# Altium project o_cam_esp.PrjPcb
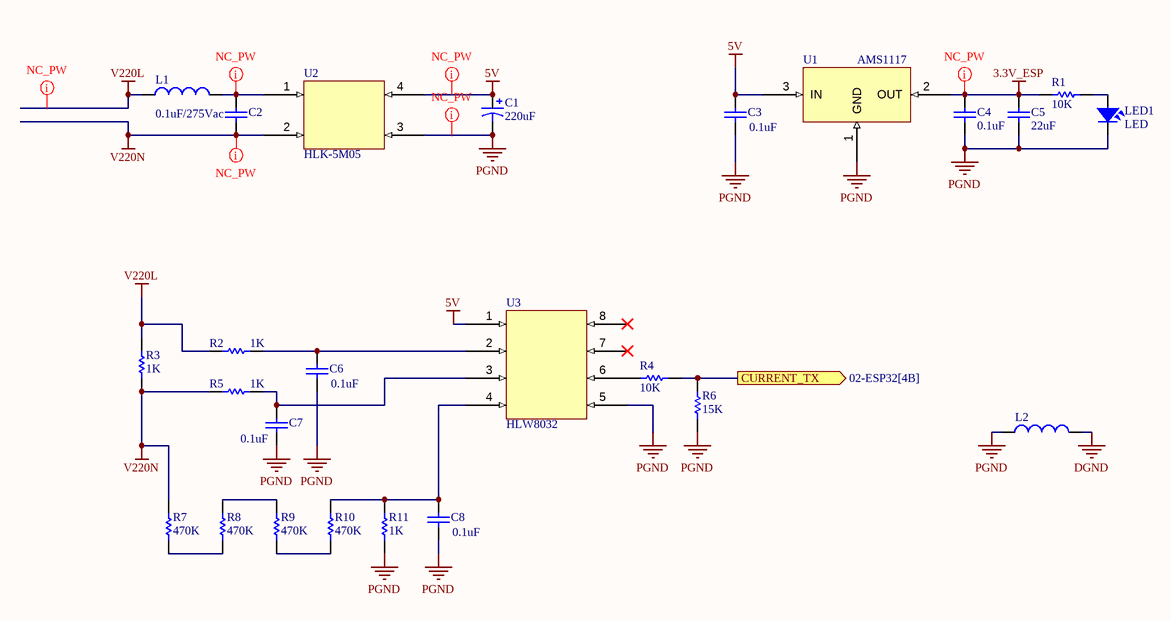
[diagram p0: 01-POWER.SchDoc]
4 sheets, 74 parts. Net scope: flat (ports and power ports of the same name join across sheets).
Board file: PCB1.PcbDoc
Sheets:
  01-POWER.SchDoc
  02-ESP32.SchDoc
  04-OUTPUT.SchDoc
  05-USB-UART.SchDoc

## Sheet 01-POWER.SchDoc: *NGUON4V4
size A4; SheetNumber: 1; SheetTotal: 4

### Parts
C1  220uF  [CAP ALU CASE G SMD]
C2  0.1uF/275Vac  [CN2]
C3  0.1uF  [CAP_CERA_C2012(CC0805INCH)]
C4  0.1uF  [CAP_CERA_C2012(CC0805INCH)]
C5  22uF  [CAP TANT CASE A SMD]
C6  0.1uF  [Cap Ceramic 0603 SMD]
C7  0.1uF  [Cap Ceramic 0603 SMD]
C8  0.1uF  [Cap Ceramic 0603 SMD]
L1  ASPI-7318-8R2M-TCT-ND  [FUSE2_5A]  (value not drawn)
L2  ASPI-7318-8R2M-TCT-ND  [RES-ERJ3G-1608MM]  (value not drawn)
LED1  LED  [LED5R]
R1  10K  [Res 0603 SMD]
R2  1K  [Res 0603 SMD]
R3  1K  [CFR25S]
R4  10K  [Res 0603 SMD]
R5  1K  [Res 0603 SMD]
R6  15K  [Res 0603 SMD]
R7  470K  [Res 0603 SMD]
R8  470K  [Res 0603 SMD]
R9  470K  [Res 0603 SMD]
R10  470K  [Res 0603 SMD]
R11  1K  [Res 0603 SMD]
U1  AMS1117  [AMS1117-3.3V]
U2  HLK-5M05  [HILINK 5V/3W]
U3  HLW8032  [SO-8]

### Ports
CURRENT_TX (out, see 02-ESP32[4B])

### Nets
3.3V_ESP: C4.2 C5.2 R1.1 U1.2(OUT)
5V: C1.1 C3.2 U1.3(IN) U2.4 U3.1
DGND: L2.2
PGND: C1.2 C3.1 C4.1 C5.1 C6.1 C7.1 C8.1 L2.1 LED1.2 R6.2 R11.1 U1.1(GND) U2.3 U3.5
V220L: L1.1 R2.2 R3.1
V220N: C2.1 R3.2 R5.2 R7.1 U2.2
NetC2_2: C2.2 L1.2 U2.1
NetC6_2: C6.2 R2.1 U3.2
NetC7_2: C7.2 R5.1 U3.3
NetC8_2: C8.2 R10.1 R11.2 U3.4
NetLED1_1: LED1.1 R1.2
NetR4_1: R4.1 U3.6
NetR4_2: R4.2 R6.1 ; port CURRENT_TX
NetR7_2: R7.2 R8.2
NetR8_1: R8.1 R9.1
NetR9_2: R9.2 R10.2

Not connected (* = marked no-connect by the designer): U3 7* 8*

### Layout directives
net class NC_PW: 3.3V_ESP, 5V, NetC2_2, PGND, V220L, V220N

### Notes on the sheet
- DWG. NO.
- REV.
- SHT.
- THIS DOCUMENT AND THE DATA DISCLOSED HEREIN OR HEREWITH IS THE PROPERTY OF ALTIUM LIMITED AND MAY BE FREELY DISTRIBUTED IN WHOLE. NO RIGHTS ARE RESERVED OR EXPRESS OR IMPLIED WARANTEE GIVEN.
- REVISION
- DESCRIPTION
- DATE
- APPROVED
- ENG:
- APPROVALS
- PROJECT
- DSN:
- CHK:
- REFERENCE DOCUMENTS
- PROJECT REVISION:
- TITLE
- DOCUMENT REVISION:
- DESIGN ITEM:
- BOM:
- FAB DWG:
- PCB DWG:
- ASSY DWG:
- SCALE:
- SIZE
- B
- CAGE CODE
- FILE NAME
- DWG NO.
- SHEET
- OF
- REV

### Library data of the parts
C1 = 330uF/50V/ALU12.5X20mm/20%/7000Hrs: CAP ALU 220UF 20% 50V SMD; Manufacturer: Nichicon; Manufacturer Part Number: UPW1J331MHD; Lifetime @ Temp.: 7000 Hrs @ 105°C; Polarization: Polar; Ripple Current - Low Frequency: 838.5mA @ 120Hz; Ripple Current - High Frequency: 1.29A @ 100kHz; RoHS: RoHS Compliant; Category: Capacitors; Packaging: Bulk; Part Status: Active; Tolerance: ±20%; ESR (Equivalent Series Resistance): -; Operating Temperature: -55°C ~ 105°C; Applications: General Purpose; Lead Spacing: 0.197" (5.00mm); Size / Dimension: 0.492" Dia (12.50mm); Height - Seated (Max): 0.787" (20.00mm); Surface Mount Land Size: -; Mounting Type: Through Hole; Package / Case: Radial, Can; ComponentLink1URL: http://nichicon-us.com/english/products/pdfs/e-upw.pdf; ComponentLink1Description: http://nichicon-us.com/english/products/pdfs/e-upw.pdf; Supplier 1: Digi-Key; Supplier Part Number 1: PCE5121TR-ND
C2 = 0.1uF/50V/C0603/10%: Manufacturer: Murata; ComponentLink1URL: http://www.murata.com/~/media/webrenewal/support/library/catalog/products/capacitor/mlcc/c02e.ashx; ComponentLink1Description: http://www.murata.com/~/media/webrenewal/support/library/catalog/products/capacitor/mlcc/c02e.ashx; Digikey: 490-9961-1-ND
C3 C4 = 0.1uF/50V/C0603/10%: 0.1µF ±10% 25V Ceramic Capacitor X7R 0805 (2012 Metric); ComponentLink1URL: http://www.murata.com/~/media/webrenewal/support/library/catalog/products/capacitor/mlcc/c02e.ashx; ComponentLink1Description: http://www.murata.com/~/media/webrenewal/support/library/catalog/products/capacitor/mlcc/c02e.ashx; Digikey: 478-3755-1-ND
C5 = 0.1uF/50V/C0603/10%: 22µF ±20% 25V Ceramic Capacitor X5R 0805 (2012 Metric); Manufacturer: Tariff Applied; ComponentLink1URL: http://www.murata.com/~/media/webrenewal/support/library/catalog/products/capacitor/mlcc/c02e.ashx; ComponentLink1Description: http://www.murata.com/~/media/webrenewal/support/library/catalog/products/capacitor/mlcc/c02e.ashx; Digikey: 1276-2908-1-ND
C6-C8 = 0.1uF/50V/C0603/10%: CAP CER 0.1UF 50V 10% X7R 0603; Manufacturer: Murata Electronics North America; Manufacturer Part Number: GRM188R71H104KA93D; Capacitance: 0.1µF; RoHS: RoHS Compliant; Category: Capacitors; Packaging: Tape & Reel (TR); Tolerance: ±10%; Voltage - Rated: 50V; Temperature Coefficient: X7R; Mounting Type: Surface Mount, MLCC; Operating Temperature: -55°C ~ 125°C; Applications: General Purpose; Ratings: -; Package / Case: 0603 (1608 Metric); Size / Dimension: 0.063" L x 0.031" W (1.60mm x 0.80mm); Height - Seated (Max): -; Thickness (Max): 0.035" (0.90mm); Lead Spacing: -; Features: -; Lead Style: -; ComponentLink1URL: http://www.murata.com/~/media/webrenewal/support/library/catalog/products/capacitor/mlcc/c02e.ashx; ComponentLink1Description: http://www.murata.com/~/media/webrenewal/support/library/catalog/products/capacitor/mlcc/c02e.ashx; Supplier 1: Digi-Key; Supplier Part Number 1: 490-1519-1-ND
L1 L2 = Inductor: Sensible value10-15mH，current / 70-500mA; Digikey: ASPI-7318-8R2M-TCT-ND
LED1 = LED: LED Single colour Green and Red; Value: LED 3 ly Single Colour
R1 R4 = 15K/R0603/1%: RES SMD 10K OHM 1% 1/10W 0603; Manufacturer: Yageo; Manufacturer Part Number: RC0603FR-0715KL; Resistance (Ohms): 15k; Power (Watts): 0.1W, 1/10W; Temperature Coefficient: ±100ppm/°C; RoHS: RoHS Compliant; Category: Resistors; Packaging: Digi-Reel®; Tolerance: ±1%; Composition: Thick Film; Features: Moisture Resistant; Operating Temperature: -55°C ~ 155°C; Package / Case: 0603 (1608 Metric); Supplier Device Package: 0603; Size / Dimension: 0.063" L x 0.031" W (1.60mm x 0.80mm); Height: 0.022" (0.55mm); Number of Terminations: 2; ComponentLink1URL: http://www.yageo.com/NewPortal/yageodocoutput?fileName=/pdf/R-Chip/PYu-RC_Group_51_RoHS_L_3.pdf; ComponentLink1Description: http://www.yageo.com/NewPortal/yageodocoutput?fileName=/pdf/R-Chip/PYu-RC_Group_51_RoHS_L_3.pdf; Supplier 1: Digi-Key; Supplier Part Number 1: 311-15.0KHRCT-ND
R2 R3 R5 R11 = 15K/R0603/1%: RES SMD 1K OHM 1% 1/10W 0603; Manufacturer: Yageo; Manufacturer Part Number: RC0603FR-0715KL; Resistance (Ohms): 15k; Power (Watts): 0.1W, 1/10W; Temperature Coefficient: ±100ppm/°C; RoHS: RoHS Compliant; Category: Resistors; Packaging: Digi-Reel®; Tolerance: ±1%; Composition: Thick Film; Features: Moisture Resistant; Operating Temperature: -55°C ~ 155°C; Package / Case: 0603 (1608 Metric); Supplier Device Package: 0603; Size / Dimension: 0.063" L x 0.031" W (1.60mm x 0.80mm); Height: 0.022" (0.55mm); Number of Terminations: 2; ComponentLink1URL: http://www.yageo.com/NewPortal/yageodocoutput?fileName=/pdf/R-Chip/PYu-RC_Group_51_RoHS_L_3.pdf; ComponentLink1Description: http://www.yageo.com/NewPortal/yageodocoutput?fileName=/pdf/R-Chip/PYu-RC_Group_51_RoHS_L_3.pdf; Supplier 1: Digi-Key; Supplier Part Number 1: 311-15.0KHRCT-ND
R6 = 15K/R0603/1%: RES SMD 15K OHM 1% 1/10W 0603; Manufacturer: Yageo; Manufacturer Part Number: RC0603FR-0715KL; Power (Watts): 0.1W, 1/10W; Temperature Coefficient: ±100ppm/°C; RoHS: RoHS Compliant; Category: Resistors; Packaging: Digi-Reel®; Resistance (Ohms): 15k; Tolerance: ±1%; Composition: Thick Film; Features: Moisture Resistant; Operating Temperature: -55°C ~ 155°C; Package / Case: 0603 (1608 Metric); Supplier Device Package: 0603; Size / Dimension: 0.063" L x 0.031" W (1.60mm x 0.80mm); Height: 0.022" (0.55mm); Number of Terminations: 2; ComponentLink1URL: http://www.yageo.com/NewPortal/yageodocoutput?fileName=/pdf/R-Chip/PYu-RC_Group_51_RoHS_L_3.pdf; ComponentLink1Description: http://www.yageo.com/NewPortal/yageodocoutput?fileName=/pdf/R-Chip/PYu-RC_Group_51_RoHS_L_3.pdf; Supplier 1: Digi-Key; Supplier Part Number 1: 311-15.0KHRCT-ND
R7-R10 = 15K/R0603/1%: RES SMD 470K OHM 1% 1/10W 0603; Manufacturer: Yageo; Manufacturer Part Number: RC0603FR-0715KL; Resistance (Ohms): 15k; Power (Watts): 0.1W, 1/10W; Temperature Coefficient: ±100ppm/°C; RoHS: RoHS Compliant; Category: Resistors; Packaging: Digi-Reel®; Tolerance: ±1%; Composition: Thick Film; Features: Moisture Resistant; Operating Temperature: -55°C ~ 155°C; Package / Case: 0603 (1608 Metric); Supplier Device Package: 0603; Size / Dimension: 0.063" L x 0.031" W (1.60mm x 0.80mm); Height: 0.022" (0.55mm); Number of Terminations: 2; ComponentLink1URL: http://www.yageo.com/NewPortal/yageodocoutput?fileName=/pdf/R-Chip/PYu-RC_Group_51_RoHS_L_3.pdf; ComponentLink1Description: http://www.yageo.com/NewPortal/yageodocoutput?fileName=/pdf/R-Chip/PYu-RC_Group_51_RoHS_L_3.pdf; Supplier 1: Digi-Key; Supplier Part Number 1: 311-15.0KHRCT-ND

## Sheet 02-ESP32.SchDoc: *ESP32LX6
size A4; SheetNumber: 2; SheetTotal: 4
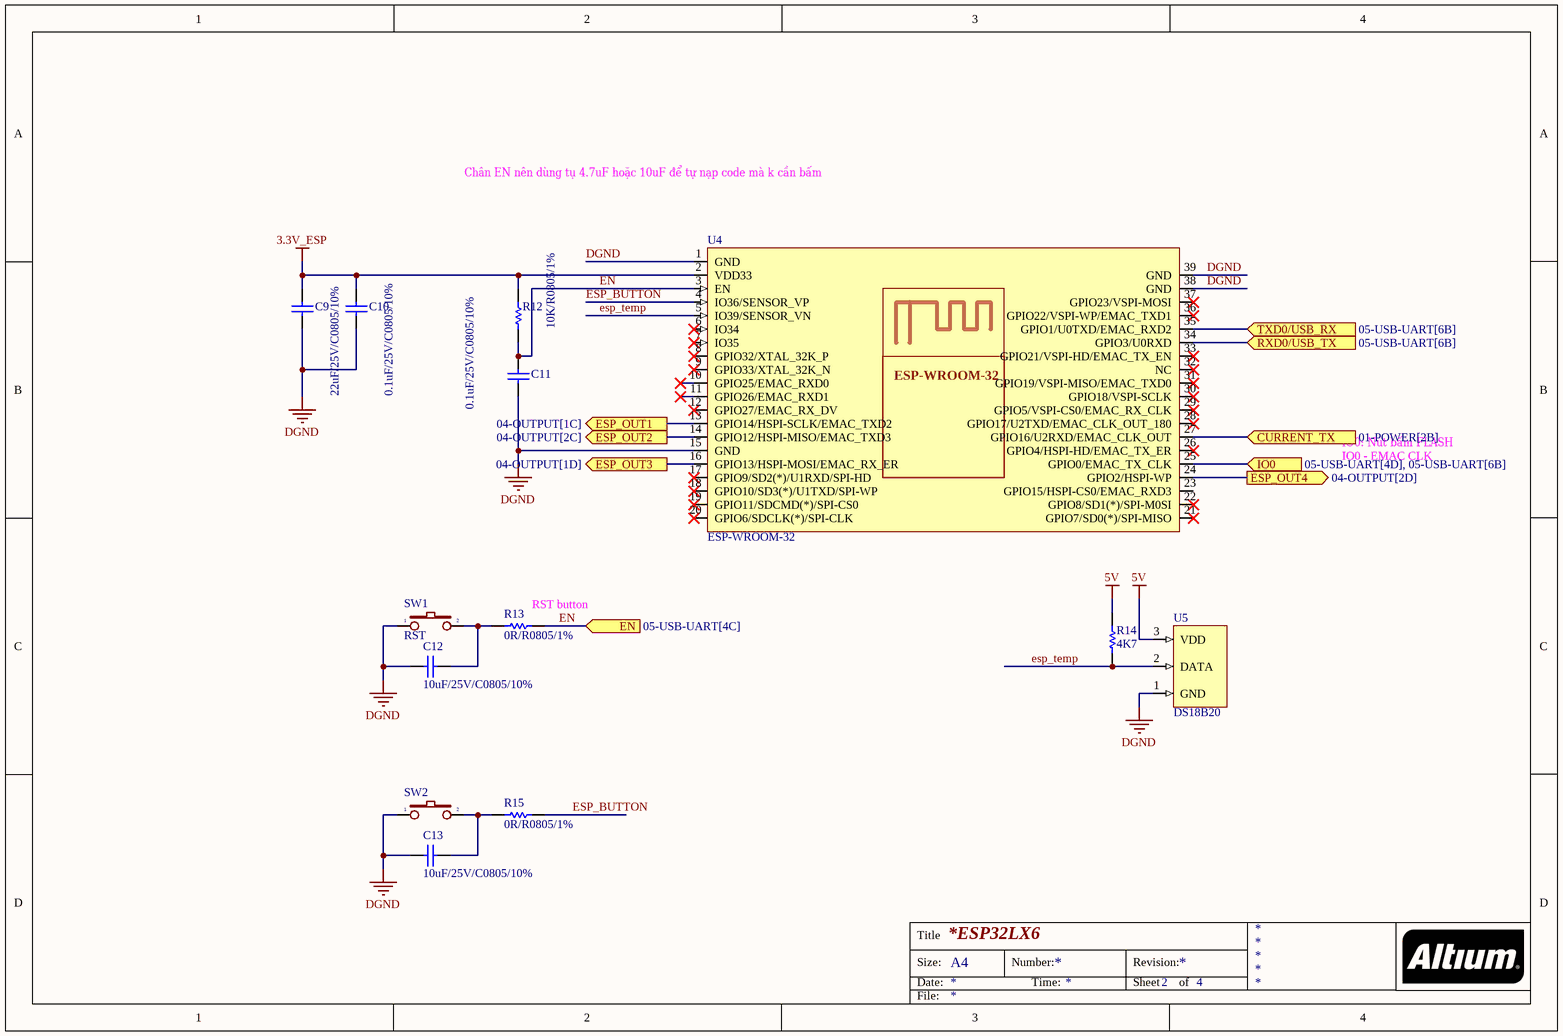
[diagram p1: 02-ESP32.SchDoc]

### Parts
C9  22uF/25V/C0805/10%  [CAP_CERA_C2012(CC0805INCH)]
C10  0.1uF/25V/C0805/10%  [CAP_CERA_C2012(CC0805INCH)]
C11  0.1uF/25V/C0805/10%  [CAP_CERA_C2012(CC0805INCH)]
C12  10uF/25V/C0805/10%  [CAP_CERA_C2012(CC0805INCH)]
C13  10uF/25V/C0805/10%  [CAP_CERA_C2012(CC0805INCH)]
R12  10K/R0805/1%  [Res 0805 SMD]
R13  0R/R0805/1%  [Res 0805 SMD]
R14  4K7  [Res 0805 SMD]
R15  0R/R0805/1%  [Res 0805 SMD]
SW1  RST  [Button 3x4mm]
SW2  RST  [Button 3x4mm]  (value not drawn)
U4  ESP-WROOM-32  [ESP32 WROOM]
U5  DS18B20  [P2N2222AG]

### Ports
CURRENT_TX (in, see 01-POWER[2B]), EN (in, see 05-USB-UART[4C]), ESP_OUT1 (out, see 04-OUTPUT[1C]), ESP_OUT2 (out, see 04-OUTPUT[2C]), ESP_OUT3 (out, see 04-OUTPUT[1D]), ESP_OUT4 (out, see 04-OUTPUT[2D]), IO0 (in, see 05-USB-UART[4D], 05-USB-UART[6B]), RXD0/USB_TX (in, see 05-USB-UART[6B]), TXD0/USB_RX (in, see 05-USB-UART[6B])

### Nets
3.3V_ESP: C9.2 C10.2 R12.1 U4.2(VDD33)
5V: R14.2 U5.3(VDD)
DGND: C9.1 C10.1 C11.1 C12.2 C13.2 SW1.1 SW2.1 U4.1(GND) U4.15(GND) U4.38(GND) U4.39(GND) U5.1(GND)
EN: C11.2 R12.2 R13.2 U4.3(EN) ; port EN
ESP_BUTTON: R15.2 U4.4(IO36/SENSOR_VP)
esp_temp: R14.1 U4.5(IO39/SENSOR_VN) U5.2(DATA)
IO0: U4.25(GPIO0/EMAC_TX_CLK) ; port IO0
NetC12_1: C12.1 R13.1 SW1.2
NetC13_1: C13.1 R15.1 SW2.2
NetR4_2: U4.27(GPIO16/U2RXD/EMAC_CLK_OUT) ; port CURRENT_TX
NetR22_1: U4.34(GPIO3/U0RXD) ; port RXD0/USB_TX
NetR23_1: U4.35(GPIO1/U0TXD/EMAC_RXD2) ; port TXD0/USB_RX
NetU4_13: U4.13(GPIO14/HSPI-SCLK/EMAC_TXD2) ; port ESP_OUT1
NetU4_14: U4.14(GPIO12/HSPI-MISO/EMAC_TXD3) ; port ESP_OUT2
NetU4_16: U4.16(GPIO13/HSPI-MOSI/EMAC_RX_ER) ; port ESP_OUT3
NetU4_24: U4.24(GPIO2/HSPI-WP) ; port ESP_OUT4

Not connected (* = marked no-connect by the designer): U4 6(IO34)* 7(IO35)* 8(GPIO32/XTAL_32K_P)* 9(GPIO33/XTAL_32K_N)* 10(GPIO25/EMAC_RXD0)* 11(GPIO26/EMAC_RXD1)* 12(GPIO27/EMAC_RX_DV)* 17(GPIO9/SD2(*)/U1RXD/SPI-HD)* 18(GPIO10/SD3(*)/U1TXD/SPI-WP)* 19(GPIO11/SDCMD(*)/SPI-CS0)* 20(GPIO6/SDCLK(*)/SPI-CLK)* 21(GPIO7/SD0(*)/SPI-MISO)* 22(GPIO8/SD1(*)/SPI-M0SI)* 23(GPIO15/HSPI-CS0/EMAC_RXD3) 26(GPIO4/HSPI-HD/EMAC_TX_ER)* 28(GPIO17/U2TXD/EMAC_CLK_OUT_180)* 29(GPIO5/VSPI-CS0/EMAC_RX_CLK)* 30(GPIO18/VSPI-SCLK)* 31(GPIO19/VSPI-MISO/EMAC_TXD0)* 32(NC)* 33(GPIO21/VSPI-HD/EMAC_TX_EN)* 36(GPIO22/VSPI-WP/EMAC_TXD1)* 37(GPIO23/VSPI-MOSI)*

### Notes on the sheet
- Chân EN nên dùng tụ 4.7uF hoặc 10uF để tự nạp code mà k cần bấm
- IO0: Nút bấm FLASH
- IO0 - EMAC CLK
- (near R13) RST button
- Title
- Size:
- Date:
- A4
- Number:
- Time:
- Revision:
- Sheet
- of
- File:

### Library data of the parts
C9 = 0.1uF/50V/C0603/10%: as C5 on sheet 01-POWER; ComponentLink1URL: http://www.murata.com/~/media/webrenewal/support/library/catalog/products/capacitor/mlcc/c02e.ashx; ComponentLink1Description: http://www.murata.com/~/media/webrenewal/support/library/catalog/products/capacitor/mlcc/c02e.ashx; Digikey: 1276-2908-1-ND
C10-C13 = 0.1uF/50V/C0603/10%: as C3 on sheet 01-POWER; ComponentLink1URL: http://www.murata.com/~/media/webrenewal/support/library/catalog/products/capacitor/mlcc/c02e.ashx; ComponentLink1Description: http://www.murata.com/~/media/webrenewal/support/library/catalog/products/capacitor/mlcc/c02e.ashx; Digikey: 478-3755-1-ND
R12 = 200K/R0603/1%: 10 kOhms ±1% 0.125W, 1/8W Chip Resistor 0805 (2012 Metric) Thick Film; Power (Watts): 0.1W, 1/10W; RoHS: RoHS Compliant; Category: Resistors; Part Status: Active; Features: Moisture Resistant; Operating Temperature: -55°C ~ 155°C; Package / Case: 0603 (1608 Metric); Supplier Device Package: 0603; Size / Dimension: 0.063" L x 0.031" W (1.60mm x 0.80mm); Height - Seated (Max): 0.022" (0.55mm); Failure Rate: -; ComponentLink1URL: http://www.yageo.com/documents/recent/PYu-RC_Group_51_RoHS_L_7.pdf; ComponentLink1Description: http://www.yageo.com/documents/recent/PYu-RC_Group_51_RoHS_L_7.pdf; Digikey: A126332CT-ND
R13 R15 = 200K/R0603/1%: 0 Ohms Jumper 0.125W, 1/8W Chip Resistor 0805 (2012 Metric) Automotive AEC-Q200 Thick Film; Part Status: Active; Height - Seated (Max): 0.022" (0.55mm); Failure Rate: -; ComponentLink1URL: http://www.yageo.com/documents/recent/PYu-RC_Group_51_RoHS_L_7.pdf; ComponentLink1Description: http://www.yageo.com/documents/recent/PYu-RC_Group_51_RoHS_L_7.pdf; Digikey: 541-0.0ACT-ND
R14 = 200K/R0603/1%: 4k7 Ohms Jumper 0.125W, 1/8W Chip Resistor 0805 (2012 Metric); Part Status: Active; Height - Seated (Max): 0.022" (0.55mm); Failure Rate: -; ComponentLink1URL: http://www.yageo.com/documents/recent/PYu-RC_Group_51_RoHS_L_7.pdf; ComponentLink1Description: http://www.yageo.com/documents/recent/PYu-RC_Group_51_RoHS_L_7.pdf; Digikey: 541-0.0ACT-ND
SW1 SW2 = SW2: SWITCH TACTILE SPST-NO 0.05A 12V; Digikey: CKN10384CT-ND
U4 = ESP-WROOM-32: ESP-WROOM-32 (8MB), WIFI MODULE 64 MBITS SPI FLASH; Digikey: 1904-1019-1-ND

## Sheet 04-OUTPUT.SchDoc: *OUTPUT
size A; SheetNumber: 3; SheetTotal: 4
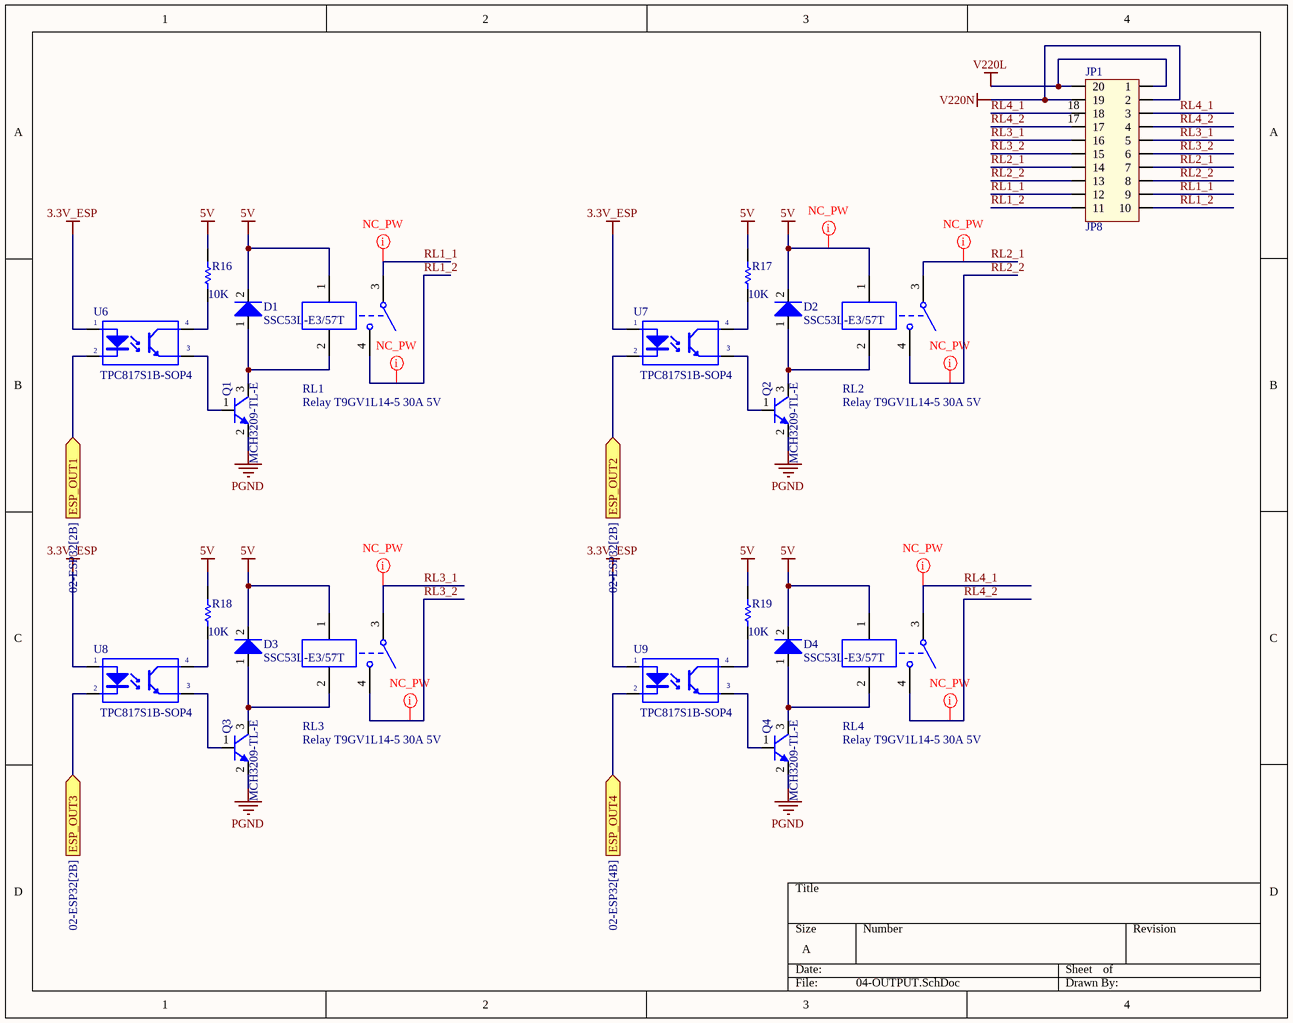
[diagram p2: 04-OUTPUT.SchDoc]

### Parts
D1  SSC53L-E3/57T  [1n4007 smd DO214]
D2  SSC53L-E3/57T  [1n4007 smd DO214]
D3  SSC53L-E3/57T  [1n4007 smd DO214]
D4  SSC53L-E3/57T  [1n4007 smd DO214]
JP1  JP8  [KF142V 10PIN]
Q1  MCH3209-TL-E  [MCH3209-TL-E  SOT-323]
Q2  MCH3209-TL-E  [MCH3209-TL-E  SOT-323]
Q3  MCH3209-TL-E  [MCH3209-TL-E  SOT-323]
Q4  MCH3209-TL-E  [MCH3209-TL-E  SOT-323]
R16  10K  [Res 0805 SMD]
R17  10K  [Res 0805 SMD]
R18  10K  [Res 0805 SMD]
R19  10K  [Res 0805 SMD]
RL1  Relay T9GV1L14-5 30A 5V  [RELAY_PA1A_PAN]
RL2  Relay T9GV1L14-5 30A 5V  [RELAY_PA1A_PAN]
RL3  Relay T9GV1L14-5 30A 5V  [RELAY_PA1A_PAN]
RL4  Relay T9GV1L14-5 30A 5V  [RELAY_PA1A_PAN]
U6  TPC817S1B-SOP4  [TPC817-4SOP]
U7  TPC817S1B-SOP4  [TPC817-4SOP]
U8  TPC817S1B-SOP4  [TPC817-4SOP]
U9  TPC817S1B-SOP4  [TPC817-4SOP]

### Ports
ESP_OUT1 (in, see 02-ESP32[2B]), ESP_OUT2 (in, see 02-ESP32[2B]), ESP_OUT3 (in, see 02-ESP32[2B]), ESP_OUT4 (in, see 02-ESP32[4B])

### Nets
3.3V_ESP: U6.1(A) U7.1(A) U8.1(A) U9.1(A)
5V: D1.2(K) D2.2(K) D3.2(K) D4.2(K) R16.2 R17.2 R18.2 R19.2 RL1.1 RL2.1 RL3.1 RL4.1
PGND: Q1.2(E) Q2.2(E) Q3.2(E) Q4.2(E)
V220L: JP1.1 JP1.20
V220N: JP1.2 JP1.19
RL1_1: JP1.9 JP1.12 RL1.3
RL1_2: JP1.10 JP1.11 RL1.4
RL2_1: JP1.7 JP1.14 RL2.3
RL2_2: JP1.8 JP1.13 RL2.4
RL3_1: JP1.5 JP1.16 RL3.3
RL3_2: JP1.6 JP1.15 RL3.4
RL4_1: JP1.3 JP1.18 RL4.3
RL4_2: JP1.4 JP1.17 RL4.4
NetD1_1: D1.1(A) Q1.3(C) RL1.2
NetD2_1: D2.1(A) Q2.3(C) RL2.2
NetD3_1: D3.1(A) Q3.3(C) RL3.2
NetD4_1: D4.1(A) Q4.3(C) RL4.2
NetQ1_1: Q1.1(B) U6.3(E)
NetQ2_1: Q2.1(B) U7.3(E)
NetQ3_1: Q3.1(B) U8.3(E)
NetQ4_1: Q4.1(B) U9.3(E)
NetR16_1: R16.1 U6.4(C)
NetR17_1: R17.1 U7.4(C)
NetR18_1: R18.1 U8.4(C)
NetR19_1: R19.1 U9.4(C)
NetU4_13: U6.2(K) ; port ESP_OUT1
NetU4_14: U7.2(K) ; port ESP_OUT2
NetU4_16: U8.2(K) ; port ESP_OUT3
NetU4_24: U9.2(K) ; port ESP_OUT4

### Layout directives
net class NC_PW: 5V, RL1_1, RL1_2, RL2_1, RL2_2, RL3_1, RL3_2, RL4_1, RL4_2

### Library data of the parts
D1-D4 = 10A10: DIODE SCHOTTKY 30V 5A DO214AB; ComponentLink1Description: Datasheet; ComponentLink1URL: D:\Dropbox\Datasheets\Diodes and Rectifiers\Diodes\10AXX.pdf; Digikey: SSC53L-E3/57TGICT-ND
JP1 = Terminal KF142 10pin: Terminal KF142 9pin; Value: Connector 8
Q1-Q4 = 2SC1815: Bipolar (BJT) Transistor NPN 30V 3A 450MHz 800mW Surface Mount 3-MCPH; ComponentLink1Description: Datasheet; ComponentLink1URL: D:\Dropbox\Datasheets\Transistors\P Channel Bipolar\2SC1815.pdf; Digikey: MCH3209-TL-EOSCT-ND
R16-R19 = 249K/R0805/1%: RES SMD 249K OHM 1% 1/10W 0805; Manufacturer: Yageo; Manufacturer Part Number: RC0603FR-07249KL; Power (Watts): 0.1W, 1/10W; Temperature Coefficient: ±100ppm/°C; Supplier 1: Digi-Key; RoHS: RoHS Compliant; Category: Resistors; Stock 1: 370515; Pricing 1: 1=0.1, 10=0.015, 100=0.006, 1000=0.00268, 2500=0.00233 (USD); Packaging: Cut Tape (CT); Part Status: Active; Tolerance: ±1%; Composition: Thick Film; Features: Moisture Resistant; Operating Temperature: -55°C ~ 155°C; Package / Case: 0603 (1608 Metric); Supplier Device Package: 0603; Size / Dimension: 0.063" L x 0.032" W (1.60mm x 0.80mm); Height - Seated (Max): 0.022" (0.55mm); Failure Rate: -; ComponentLink1URL: http://www.yageo.com/documents/recent/PYu-RC_Group_51_RoHS_L_8.pdf; ComponentLink1Description: http://www.yageo.com/documents/recent/PYu-RC_Group_51_RoHS_L_8.pdf
RL1-RL4 = Relay T9GV1L14-5 30A 5V: General Purpose Relay SPST-NO (1 Form A) 5VDC Coil Through Hole; Digikey: T9GV1L14-5
U6-U9 = PC817: Optoisolator Transistor Output 5000Vrms 1 Channel 4-SOP; Digikey: TPC817S1BRAGCT-ND

## Sheet 05-USB-UART.SchDoc: *USBTOUART
size A3; SheetNumber: 4; SheetTotal: 4
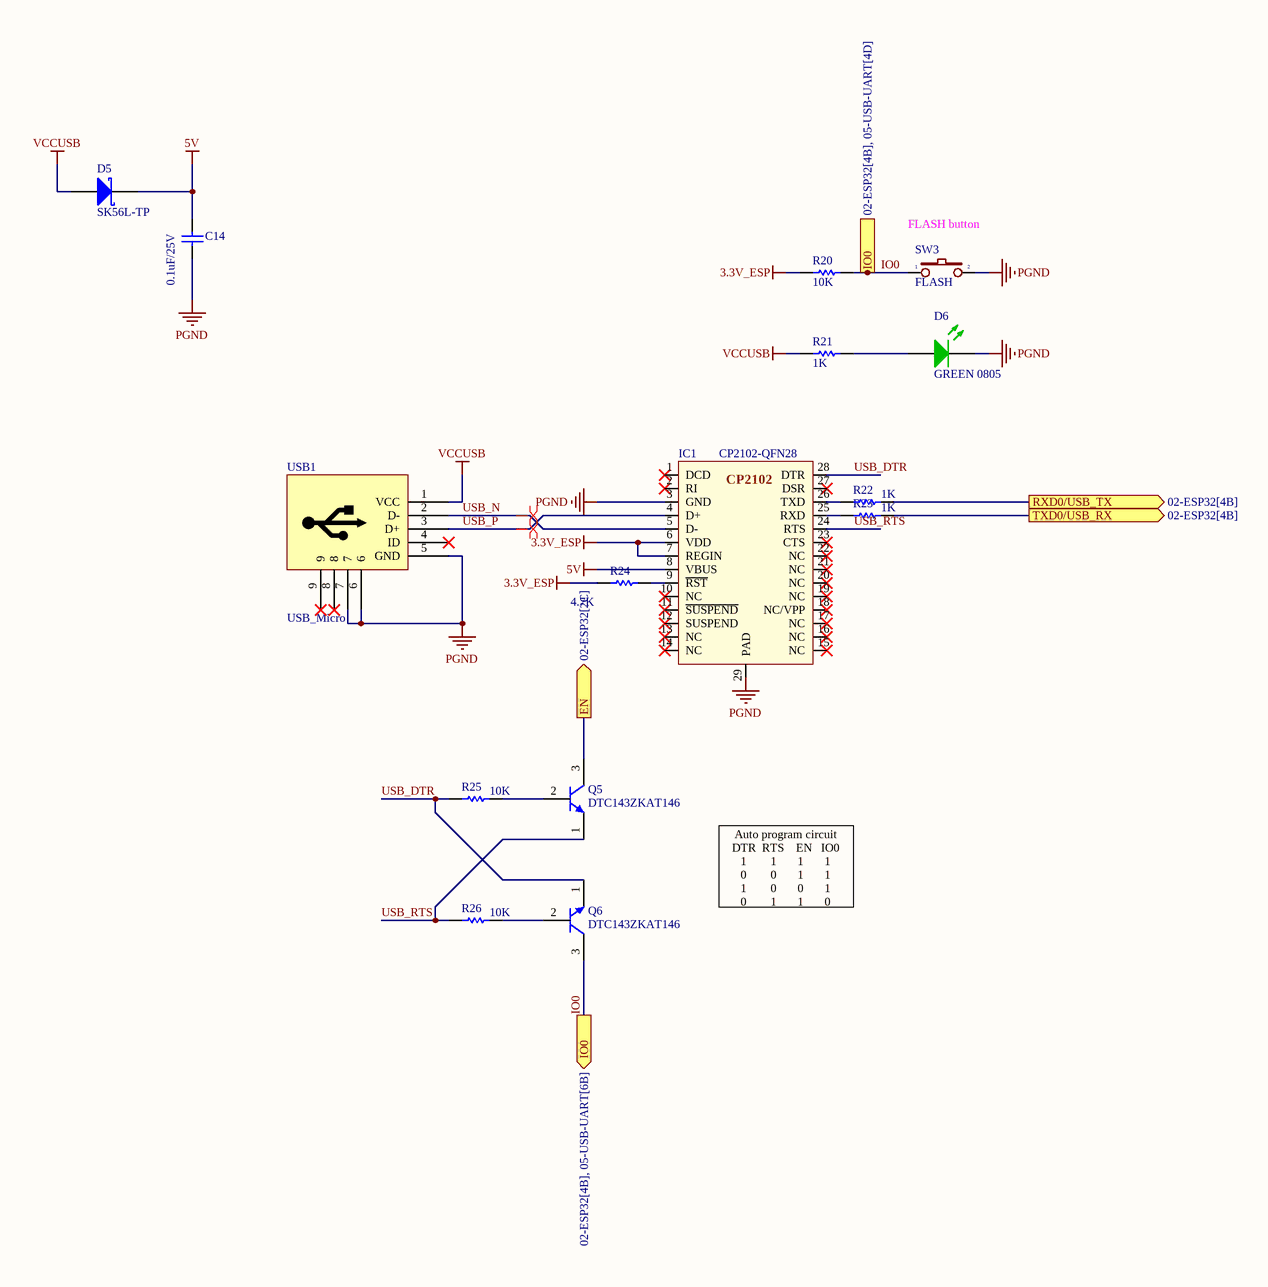
[diagram p3: 05-USB-UART.SchDoc]

### Parts
C14  0.1uF/25V  [CAP_CERA_C2012(CC0805INCH)]
D5  SK56L-TP  [30# SK56L-TPMSCT-ND]
D6  GREEN 0805  [Led 0805G]
IC1  CP2102-QFN28  [CP2102-QFN28]
Q5  DTC143ZKAT146  [6# DTC143ZKAT146-E]
Q6  DTC143ZKAT146  [6# DTC143ZKAT146-E]
R20  10K  [Res 0805 SMD]
R21  1K  [Res 0805 SMD]
R22  1K  [Res 0805 SMD]
R23  1K  [Res 0805 SMD]
R24  4.7K  [Res 0805 SMD]
R25  10K  [Res 0805 SMD]
R26  10K  [Res 0805 SMD]
SW3  FLASH  [Button 3x4mm]
USB1  USB_Micro  [USB_MICRO_B - Digikey]

### Ports
EN (out, see 02-ESP32[2C]), IO0 (out, see 02-ESP32[4B], 05-USB-UART[4D]), IO0 (out, see 02-ESP32[4B], 05-USB-UART[6B]), RXD0/USB_TX (out, see 02-ESP32[4B]), TXD0/USB_RX (out, see 02-ESP32[4B])

### Nets
3.3V_ESP: IC1.6(VDD) IC1.7(REGIN) R20.1 R24.1
5V: C14.2 D5.2(K) IC1.8(VBUS)
PGND: C14.1 D6.2(K) IC1.3(GND) IC1.29(PAD) SW3.2 USB1.5(GND) USB1.6 USB1.7
VCCUSB: D5.1(A) R21.1 USB1.1(VCC)
EN: Q5.3(C) ; port EN
IO0: Q6.3(C) R20.2 SW3.1 ; port IO0
USB_DTR: IC1.28(DTR) Q6.1(E) R25.2
USB_N: IC1.5(D-) USB1.2(D-)
USB_P: IC1.4(D+) USB1.3(D+)
USB_RTS: IC1.24(RTS) Q5.1(E) R26.2
NetD6_1: D6.1(A) R21.2
NetIC1_9: IC1.9(~{RST}) R24.2
NetIC1_25: IC1.25(RXD) R23.2
NetIC1_26: IC1.26(TXD) R22.2
NetQ5_2: Q5.2(B) R25.1
NetQ6_2: Q6.2(B) R26.1
NetR22_1: R22.1 ; port RXD0/USB_TX
NetR23_1: R23.1 ; port TXD0/USB_RX

Not connected (* = marked no-connect by the designer): IC1 1(DCD)* 2(RI)* 10(NC)* 11(~{SUSPEND})* 12(SUSPEND)* 13(NC)* 14(NC)* 15(NC)* 16(NC)* 17(NC)* 18(NC/VPP)* 19(NC)* 20(NC)* 21(NC)* 22(NC)* 23(CTS)* 27(DSR)*; USB1 4(ID)* 8* 9*

### Layout directives
differential pair; differential pair class DIFF90; net class NC90: USB_N, USB_P

### Notes on the sheet
- (near SW3) FLASH button
- Auto program circuit
  DTR  RTS    EN   IO0
  1        1       1       1
  0        0       1       1
  1        0       0       1
  0        1       1       0
- Title
- Size:
- Date:
- A3
- Number:
- Time:
- Revision:
- Sheet
- of
- File:

### Library data of the parts
C14 = 0.1uF/50V/C0603/10%: as C3 on sheet 01-POWER; ComponentLink1URL: http://www.murata.com/~/media/webrenewal/support/library/catalog/products/capacitor/mlcc/c02e.ashx; ComponentLink1Description: http://www.murata.com/~/media/webrenewal/support/library/catalog/products/capacitor/mlcc/c02e.ashx; Digikey: 478-3755-1-ND
D5 = 30# SK56L-TP: DIODE SCHOTTKY 60V 5A DO214AB; ComponentLink1URL: http://www.mccsemi.com/up_pdf/SK52L-SK510L(DO-214AB).PDF; ComponentLink1Description: http://www.mccsemi.com/up_pdf/SK52L-SK510L(DO-214AB).PDF; Digikey: SK56L-TPMSCT-ND
D6 = LED GREEN 0603: Green 571nm LED Indication - Discrete 2V 0805 (2012 Metric); ComponentLink1URL: http://optoelectronics.liteon.com/upload/download/DS22-2000-074/S_110_LTST-C190KGKT.pdf; ComponentLink1Description: http://optoelectronics.liteon.com/upload/download/DS22-2000-074/S_110_LTST-C190KGKT.pdf; Digikey: 160-1426-1-ND
IC1 = CP2102: USB Bridge, USB to UART USB 2.0 UART Interface 28-QFN (5x5); Digikey: 336-3694-ND; VNBuy: https://banlinhkien.vn/goods-2607-cp2102-qfn28.html
Q5 Q6 = 6#DTC143ZKAT146: Pre-Biased Bipolar Transistor (BJT) NPN - Pre-Biased 50V 100mA 250MHz 200mW Surface Mount SMT3; Digikey: DTC143ZKAT146CT-ND
R20 = 200K/R0603/1%: as R12 on sheet 02-ESP32; RoHS: RoHS Compliant; Category: Resistors; Part Status: Active; Features: Moisture Resistant; Operating Temperature: -55°C ~ 155°C; Package / Case: 0603 (1608 Metric); Supplier Device Package: 0603; Size / Dimension: 0.063" L x 0.031" W (1.60mm x 0.80mm); Height - Seated (Max): 0.022" (0.55mm); Failure Rate: -; ComponentLink1URL: http://www.yageo.com/documents/recent/PYu-RC_Group_51_RoHS_L_7.pdf; ComponentLink1Description: http://www.yageo.com/documents/recent/PYu-RC_Group_51_RoHS_L_7.pdf; Digikey: A126332CT-ND
R21 = 200K/R0603/1%: 1 kOhms ±1% 0.125W, 1/8W Chip Resistor 0805 (2012 Metric) Automotive AEC-Q200 Thick Film; Power (Watts): 0.1W, 1/10W; RoHS: RoHS Compliant; Category: Resistors; Part Status: Active; Features: Moisture Resistant; Operating Temperature: -55°C ~ 155°C; Package / Case: 0603 (1608 Metric); Supplier Device Package: 0603; Size / Dimension: 0.063" L x 0.031" W (1.60mm x 0.80mm); Height - Seated (Max): 0.022" (0.55mm); Failure Rate: -; ComponentLink1URL: http://www.yageo.com/documents/recent/PYu-RC_Group_51_RoHS_L_7.pdf; ComponentLink1Description: http://www.yageo.com/documents/recent/PYu-RC_Group_51_RoHS_L_7.pdf; Digikey: 541-1.00KCCT-ND
R22 R23 = 34.8K/R0805/1%: 1 kOhms ±1% 0.125W, 1/8W Chip Resistor 0805 (2012 Metric) Automotive AEC-Q200 Thick Film; Power Rating: 100mW; Resistance: 34.8kR; Voltage Rating: 50V; Case/Package: 0603; Case Code (Imperial): 0603; Case Code (Metric): 1608; Min Operating Temperature: -55°C; Max Operating Temperature: 155°C; Termination: SMD/SMT; Military Standard: Not; Voltage Rating (DC): 50V; Length: 1.6mm; Height: 0.45mm; Width: 0.8mm; Depth: 0.8mm; Lead Free: Lead Free; Digikey: 541-1.00KCCT-ND
R24 = 34.8K/R0805/1%: 4.7 kOhms ±1% 0.125W, 1/8W Chip Resistor 0805 (2012 Metric) Thick Film; Digikey: 541-4131-1-ND
R25 R26 = 34.8K/R0805/1%: 10 kOhms ±1% 0.125W, 1/8W Chip Resistor 0805 (2012 Metric) Thick Film; Power Rating: 100mW; Resistance: 34.8kR; Voltage Rating: 50V; Case/Package: 0603; Case Code (Imperial): 0603; Case Code (Metric): 1608; Min Operating Temperature: -55°C; Max Operating Temperature: 155°C; Termination: SMD/SMT; Military Standard: Not; Voltage Rating (DC): 50V; Length: 1.6mm; Height: 0.45mm; Width: 0.8mm; Depth: 0.8mm; Lead Free: Lead Free; Digikey: A126332CT-ND
SW3 = SW2: SWITCH TACTILE SPST-NO 0.05A 12V; Digikey: CKN10384CT-ND
USB1 = USB_MINI: USB - micro B USB 2.0 Receptacle Connector 5 Position Surface Mount, Right Angle; Through Hole; BuyVN: https://banlinhkien.vn/goods-5145-microusb-mk5p-dip.html; Digikey: 609-4618-1-ND

## Nets that join several sheets
3.3V_ESP: 01-POWER (C4.2 C5.2 R1.1 U1.2), 02-ESP32 (C9.2 C10.2 R12.1 U4.2), 04-OUTPUT (U6.1 U7.1 U8.1 U9.1), 05-USB-UART (IC1.6 IC1.7 R20.1 R24.1)
5V: 01-POWER (5 pins), 02-ESP32 (R14.2 U5.3), 04-OUTPUT (12 pins), 05-USB-UART (C14.2 D5.2 IC1.8)
DGND: 01-POWER (L2.2), 02-ESP32 (12 pins)
PGND: 01-POWER (14 pins), 04-OUTPUT (Q1.2 Q2.2 Q3.2 Q4.2), 05-USB-UART (8 pins)
V220L: 01-POWER (L1.1 R2.2 R3.1), 04-OUTPUT (JP1.1 JP1.20)
V220N: 01-POWER (5 pins), 04-OUTPUT (JP1.2 JP1.19)
EN: 02-ESP32 (C11.2 R12.2 R13.2 U4.3), 05-USB-UART (Q5.3)
IO0: 02-ESP32 (U4.25), 05-USB-UART (Q6.3 R20.2 SW3.1)
NetR4_2: 01-POWER (R4.2 R6.1), 02-ESP32 (U4.27)
NetR22_1: 02-ESP32 (U4.34), 05-USB-UART (R22.1)
NetR23_1: 02-ESP32 (U4.35), 05-USB-UART (R23.1)
NetU4_13: 02-ESP32 (U4.13), 04-OUTPUT (U6.2)
NetU4_14: 02-ESP32 (U4.14), 04-OUTPUT (U7.2)
NetU4_16: 02-ESP32 (U4.16), 04-OUTPUT (U8.2)
NetU4_24: 02-ESP32 (U4.24), 04-OUTPUT (U9.2)